# Altium schematic sheet Potncia.SchDoc
size A4
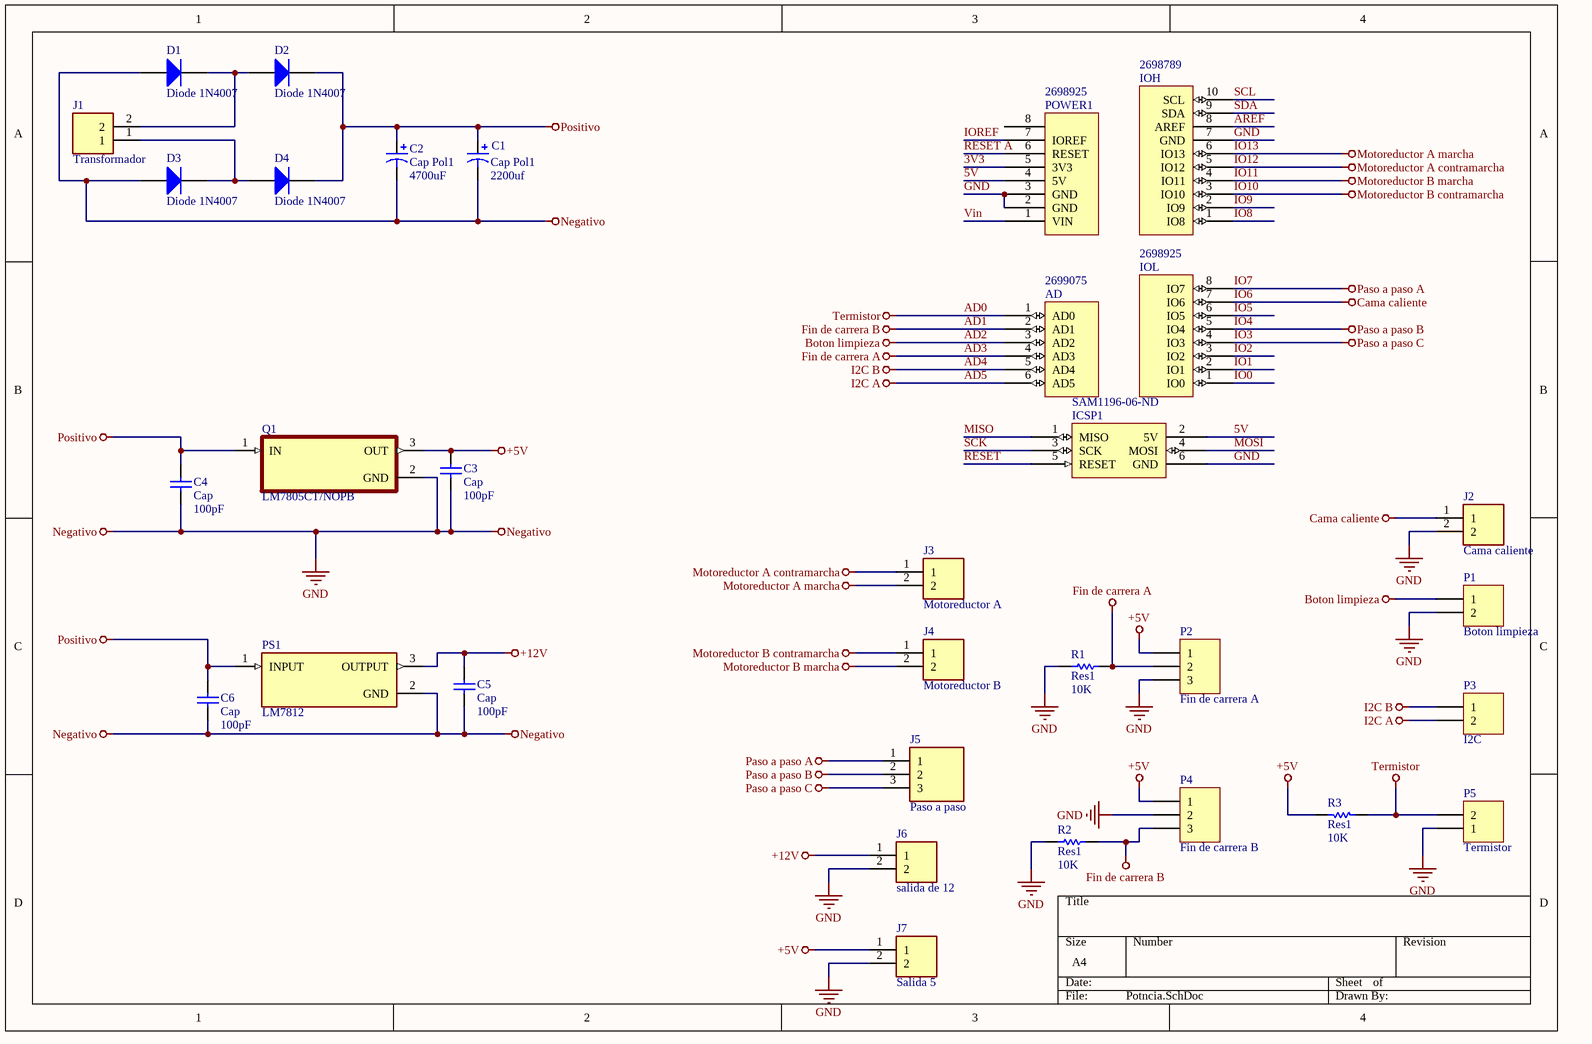
[diagram p0: Potncia.SchDoc]

## Parts
AD  Supplier Part Number 4: 2699075  [Header 6x1 8.5mm]  (hidden comment: AD)
C1  Cap Pol1  value 2200uf  [RB5-10.5]
C2  Cap Pol1  value 4700uF  [RB5-10.5]
C3  Cap  value 100pF  [RAD-0.1]
C4  Cap  value 100pF  [RAD-0.1]
C5  Cap  value 100pF  [RAD-0.1]
C6  Cap  value 100pF  [RAD-0.1]
D1  Diode 1N4007  [DO-35]
D2  Diode 1N4007  [DO-35]
D3  Diode 1N4007  [DO-35]
D4  Diode 1N4007  [DO-35]
ICSP1  Supplier Part Number 5: SAM1196-06-ND  [ICSP]  (hidden comment: ICSP)
IOH  Supplier Part Number 3: 2698789  [Header 10x1 8.5mm]  (hidden comment: IOH)
IOL  Supplier Part Number 4: 2698925  [Header 8x1 8.5mm]  (hidden comment: IOL)
J1  Comment_1: Transformador  [TE_282841-2]  (hidden comment: 282841-2)
J2  Comment_1: Cama caliente  [TE_282841-2]  (hidden comment: 282841-2)
J3  Comment_1: Motoreductor A  [TE_282841-2]  (hidden comment: 282841-2)
J4  Comment_1: Motoreductor B  [TE_282841-2]  (hidden comment: 282841-2)
J5  Comment_1: Paso a paso  [TE_1776275-3]  (hidden comment: 1776275-3)
J6  Comment_1: salida de 12  [TE_282841-2]  (hidden comment: 282841-2)
J7  Comment_1: Salida 5  [TE_282841-2]  (hidden comment: 282841-2)
P1  Boton limpieza  [HDR1X2]
P2  Fin de carrera A  [HDR1X3]
P3  I2C  [HDR1X2]
P4  Fin de carrera B  [HDR1X3]
P5  Termistor  [HDR1X2]
POWER1  Supplier Part Number 4: 2698925  [Header 8x1 8.5mm]  (hidden comment: POWER_UNO)
PS1  LM7812  [VREG_LM7812]
Q1  LM7805CT/NOPB  [TO254P1054X470X1955-3]
R1  Res1  value 10K  [AXIAL-0.3]
R2  Res1  value 10K  [AXIAL-0.3]
R3  Res1  value 10K  [AXIAL-0.3]

## Nets
+5V: C3.2 J7.1 P2.1 P4.1 Q1.3(OUT) R3.1
+12V: C5.2 J6.1 PS1.3(OUTPUT)
AD0: AD.1(AD0) P5.2 R3.2  [also labelled Termistor]
AD1: AD.2(AD1) P4.3 R2.2  [also labelled Fin de carrera B]
AD2: AD.3(AD2) P1.1  [also labelled Boton limpieza]
AD3: AD.4(AD3) P2.2 R1.2  [also labelled Fin de carrera A]
AD4: AD.5(AD4) P3.1  [also labelled I2C B]
AD5: AD.6(AD5) P3.2  [also labelled I2C A]
GND: C1.2 C2.2 C3.1 C4.1 C5.1 C6.1 D1.1(A) D3.1(A) ICSP1.6(GND) IOH.7(GND) J2.2 J6.2 J7.2 P1.2 P2.3 P4.2 P5.1 POWER1.2(GND) POWER1.3(GND) PS1.2(GND) Q1.2(GND) R1.1 R2.1  [also labelled Negativo]
IO3: IOL.4(IO3) J5.3  [also labelled Paso a paso C]
IO4: IOL.5(IO4) J5.2  [also labelled Paso a paso B]
IO6: IOL.7(IO6) J2.1  [also labelled Cama caliente]
IO7: IOL.8(IO7) J5.1  [also labelled Paso a paso A]
IO10: IOH.3(IO10) J4.1  [also labelled Motoreductor B contramarcha]
IO11: IOH.4(IO11) J4.2  [also labelled Motoreductor B marcha]
IO12: IOH.5(IO12) J3.1  [also labelled Motoreductor A contramarcha]
IO13: IOH.6(IO13) J3.2  [also labelled Motoreductor A marcha]
Positivo: C1.1 C2.1 C4.2 C6.2 D2.2(K) D4.2(K) PS1.1(INPUT) Q1.1(IN)
3V3: POWER1.5(3V3)
5V: ICSP1.2(5V) POWER1.4(5V)
AREF: IOH.8(AREF)
IO0: IOL.1(IO0)
IO1: IOL.2(IO1)
IO2: IOL.3(IO2)
IO5: IOL.6(IO5)
IO8: IOH.1(IO8)
IO9: IOH.2(IO9)
IOREF: POWER1.7(IOREF)
MISO: ICSP1.1(MISO)
MOSI: ICSP1.4(MOSI)
RESET: ICSP1.5(RESET)
RESET A: POWER1.6(RESET)
SCK: ICSP1.3(SCK)
SCL: IOH.10(SCL)
SDA: IOH.9(SDA)
Vin: POWER1.1(VIN)
NetD1_2: D1.2(K) D2.1(A) J1.2
NetD3_2: D3.2(K) D4.1(A) J1.1

Not connected (* = marked no-connect by the designer): POWER1 8

## Library data of the parts
C1 C2 = Cap Pol1: Polarized Capacitor (Radial); Published: 8-Jun-2000; LatestRevisionDate: 17-Jul-2002; LatestRevisionNote: Re-released for DXP Platform.; PackageReference: RB7.6-15; Publisher: Altium Limited; PackageDescription: Polarized Capacitor (Radial); 2 Leads
C3-C6 = Cap: Capacitor; Published: 8-Jun-2000; LatestRevisionDate: 17-Jul-2002; LatestRevisionNote: Re-released for DXP Platform.; PackageReference: RAD-0.3; Publisher: Altium Limited; PackageDescription: Radial Cap, Thru-Hole; 2 Leads; 0.3 in Pin Spacing
D1-D4 = Diode 1N914: High Conductance Fast Diode; Published: 8-Jun-2000; LatestRevisionDate: 17-Jul-2002; LatestRevisionNote: Re-released for DXP Platform.; DatasheetVersion: 1997; PackageReference: DO-35; Publisher: Altium Limited; PackageDescription: Diode, Axial; Body 3.8 x 1.9 mm (LxDia. max), Lead Dia. 0.53 mm (max); Code_JEDEC: DO-204-AH; ComponentLink1Description: Manufacturer Link; ComponentLink1URL: http://www.fairchildsemi.com/; ComponentLink2Description: Datasheet; ComponentLink2URL: http://www.fairchildsemi.com/ds/1N%2F1N4448.pdf
J1-J4 J6 J7 = 282841-2: Conn Terminal Block 2 POS 5.08mm Solder ST Thru-Hole 17.5A/Contact; MF: TE Connectivity; SnapEDA_Link: https://www.snapeda.com/parts/282841-2/TE%20Connectivity%20AMP%20Connectors/view-part/434231/?ref=snap; Availability: Unavailable; TE_purchase_URL: https://www.te.com/usa-en/product-282841-2.html?te_bu=Cor&te_type=disp&te_campaign=seda_glo_cor-seda-global-disp-prtnr-fy19-seda-model-bom-cta_sma-317_1&elqCampaignId=32493; Value: *; EU_RoHS_Compliance: Compliant with Exemptions; Price: None; MP: 282841-2; Package: None
J5 = 1776275-3: Wire-To-Board Terminal Block, 3, 250 V, 7 A, 22 Awg, 14 Awg, 2 Mm; MF: TE Connectivity; TE_purchase_URL: https://www.te.com/usa-en/product-1776275-3.html?te_bu=Cor&te_type=disp&te_campaign=seda_glo_cor-seda-global-disp-prtnr-fy19-seda-model-bom-cta_sma-317_1&elqCampaignId=32493; Package: None; MP: 1776275-3; Value: *; Price: None; Availability: Unavailable; SnapEDA_Link: https://www.snapeda.com/parts/1776275-3/TE%20Connectivity%20AMP%20Connectors/view-part/2779112/?ref=snap
P1 P3 P5 = Header 2: Header, 2-Pin; LatestRevisionDate: 17-Jul-2002; LatestRevisionNote: Re-released for DXP Platform.; Publisher: Altium Limited
P2 P4 = Header 3: Header, 3-Pin; LatestRevisionDate: 17-Jul-2002; LatestRevisionNote: Re-released for DXP Platform.; Publisher: Altium Limited
PS1 = LM7812: Linear Voltage Regulator IC 1 Output 1.5A DDPAK/TO-263-3; MF: Texas Instruments; Package: TO-220 Texas Instruments; SnapEDA_Link: https://www.snapeda.com/parts/LM7812/Texas%20Instruments/view-part/2755251/?ref=snap; Value: *; MP: LM7812; Availability: Unavailable; Price: None; BuyPart: https://www.snapeda.com/parts/LM7812/Texas%20Instruments/view-part/2755251/?ref=eda
Q1 = LM7805CT/NOPB: 1.5-A, 30-V, linear voltage regulator 3-TO-220 0 to 125; MF: Texas Instruments; Package: TO-220-3 Texas Instruments; Texas_Instruments-Purchase-URL: https://snapeda.com/shop?store=Texas+Instruments&id=6627; Value: *; Price: None; MP: LM7805CT/NOPB; Availability: Unavailable; SnapEDA_Link: https://www.snapeda.com/parts/LM7805CT/NOPB/Texas%20Instruments/view-part/6627/?ref=snap
R1-R3 = Res1: Resistor; Published: 8-Jun-2000; LatestRevisionDate: 17-Jul-2002; LatestRevisionNote: Re-released for DXP Platform.; PackageReference: AXIAL-0.3; Publisher: Altium Limited; PackageDescription: Axial Device, Thru-Hole; 2 Leads; 0.3 in Pin Spacing
AD = AD: Supplier 1: Arrow; Supplier Part Number 1: 2699089; Supplier 2: Digi-Key; Supplier Part Number 2: SAM1198-06-ND; Supplier 3: Arrow; Supplier Part Number 3: 2699088; Supplier 4: Arrow
ICSP1 = ICSP: Supplier 1: Arrow; Supplier Part Number 1: 2699117; Supplier 2: Arrow; Supplier Part Number 2: 2699116; Supplier 3: Digi-Key; Supplier Part Number 3: SAM1185-06-ND; Supplier 4: Arrow; Supplier Part Number 4: 2699091; Supplier 5: Digi-Key
IOH = IOH: Supplier 1: Arrow; Supplier Part Number 1: 2698803S4475693N1004; Supplier 2: Digi-Key; Supplier Part Number 2: SAM1198-10-ND; Supplier 3: Arrow
IOL = IOL: Supplier 1: Digi-Key; Supplier Part Number 1: SAM1198-08-ND; Supplier 2: Arrow; Supplier Part Number 2: 2698939; Supplier 3: Arrow; Supplier Part Number 3: 2698940; Supplier 4: Arrow
POWER1 = POWER_UNO: Supplier 1: Digi-Key; Supplier Part Number 1: SAM1198-08-ND; Supplier 2: Arrow; Supplier Part Number 2: 2698939; Supplier 3: Arrow; Supplier Part Number 3: 2698940; Supplier 4: Arrow